# Altium schematic sheet Sheet1.SchDoc
size A4
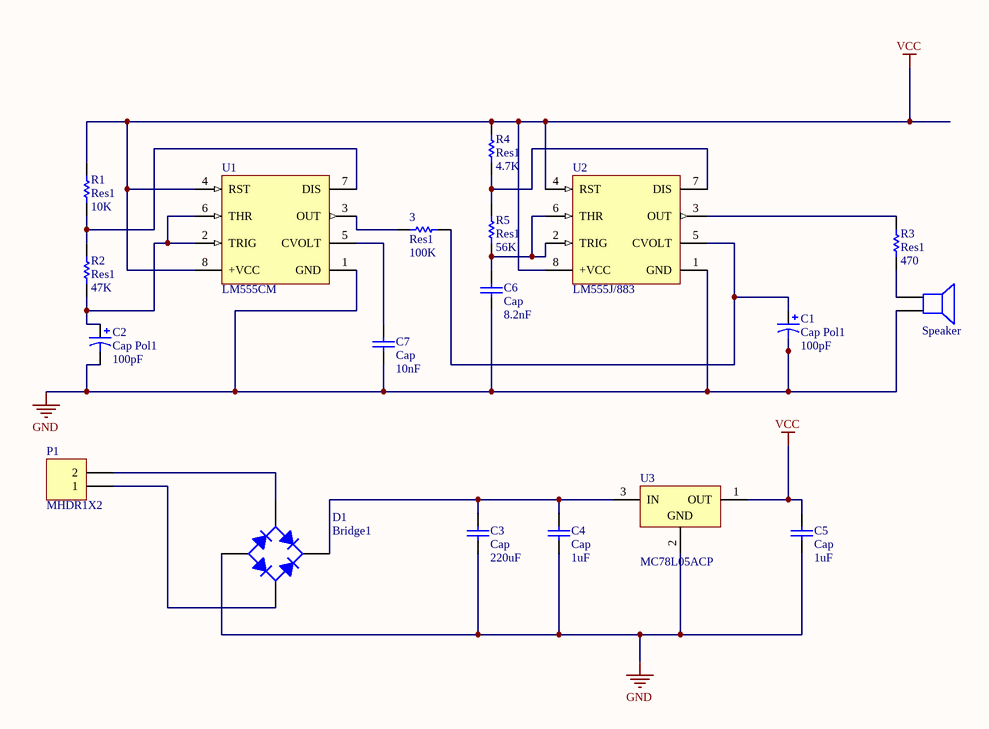
[diagram p0: Sheet1.SchDoc]

## Parts
3  Res1  value 100K  [AXIAL-0.3]
?  Speaker  [PIN2]
C1  Cap Pol1  value 100pF  [RB7.6-15]
C2  Cap Pol1  value 100pF  [RB7.6-15]
C3  Cap  value 220uF  [RAD-0.1]
C4  Cap  value 1uF  [RAD-0.1]
C5  Cap  value 1uF  [RAD-0.1]
C6  Cap  value 8.2nF  [RAD-0.1]
C7  Cap  value 10nF  [RAD-0.1]
D1  Bridge1  [D-38]
P1  MHDR1X2  [MHDR1X2]
R1  Res1  value 10K  [AXIAL-0.3]
R2  Res1  value 47K  [AXIAL-0.3]
R3  Res1  value 470  [AXIAL-0.3]
R4  Res1  value 4.7K  [AXIAL-0.3]
R5  Res1  value 56K  [AXIAL-0.3]
U1  LM555CM  [MRA08A_M]
U2  LM555J/883  [MRA08A_M]
U3  MC78L05ACP  [29-04]

## Nets
GND: ?.2 C1.2 C2.2 C3.1 C4.1 C5.1 C6.1 C7.1 D1.3(A) U1.1(GND) U2.1(GND) U3.2(GND)
VCC: C5.2 R1.2 R4.2 U1.4(RST) U1.8(+VCC) U2.4(RST) U2.8(+VCC) U3.1(OUT)
Net3_1: 3.1 U1.3(OUT)
Net3_2: 3.2 C1.1 U2.5(CVOLT)
Net?_1: ?.1 R3.1
NetC2_1: C2.1 R2.1 U1.2(TRIG) U1.6(THR)
NetC3_2: C3.2 C4.2 D1.1(K) U3.3(IN)
NetC6_2: C6.2 R5.1 U2.2(TRIG) U2.6(THR)
NetC7_2: C7.2 U1.5(CVOLT)
NetD1_2: D1.2(C) P1.1
NetD1_4: D1.4(C) P1.2
NetR1_1: R1.1 R2.2 U1.7(DIS)
NetR3_2: R3.2 U2.3(OUT)
NetR4_1: R4.1 R5.2 U2.7(DIS)

## Library data of the parts
3 R1-R5 = Res1: Resistor; Published: 8-Jun-2000; LatestRevisionDate: 17-Jul-2002; LatestRevisionNote: Re-released for DXP Platform.; PackageReference: AXIAL-0.3; Publisher: Altium Limited; PackageDescription: Axial Device, Thru-Hole; 2 Leads; 0.3 in Pin Spacing
? = Speaker: Loudspeaker; Published: 24-Mar-1999; LatestRevisionDate: 17-Jul-2002; LatestRevisionNote: Re-released for DXP Platform.; PackageReference: PIN2; Publisher: Altium Limited
C1 C2 = Cap Pol1: Polarized Capacitor (Radial); Published: 8-Jun-2000; LatestRevisionDate: 17-Jul-2002; LatestRevisionNote: Re-released for DXP Platform.; PackageReference: RB7.6-15; Publisher: Altium Limited; PackageDescription: Polarized Capacitor (Radial); 2 Leads
C3-C7 = Cap: Capacitor; Published: 8-Jun-2000; LatestRevisionDate: 17-Jul-2002; LatestRevisionNote: Re-released for DXP Platform.; PackageReference: RAD-0.3; Publisher: Altium Limited; PackageDescription: Radial Cap, Thru-Hole; 2 Leads; 0.3 in Pin Spacing
D1 = Bridge1: Full Wave Diode Bridge; Published: 8-Jun-2000; LatestRevisionDate: 29-May-2009; LatestRevisionNote: Sch pins A & K swapped.; DatasheetVersion: E2732B; PackageReference: D-38; Publisher: Altium Limited; PackageDescription: Bridge Rectifier; 4 Terminals; Body 9.4 x 9.4 mm (typ); Pitch 5.08 mm
P1 = MHDR1X2: Header, 2-Pin; LatestRevisionDate: 17-Jul-2002; LatestRevisionNote: Re-released for DXP Platform.; Publisher: Altium Limited
U1 = LM555CM: Timer, 8-pin Narrow SOIC; Manufacturer: National Semiconductor; PackageTopMarking: NSZXTT*LM*555CM; PowerWise: N; CompType: Analog IC; Published: 4-Dec-2008; DatasheetVersion: Jul-2006; PackageVersion: revM, May-2009; PackageReference: M08A; Publisher: Altium Limited; PackageDescription: SOIC Narrow, 4.9 x 3.9 x 1.45mm, 8 Lead, 1.27mm Pitch; Supplier 1: Farnell; Supplier Part Number 1: 9488227; PartNumber: LM555CM; RoHS: N; PinCount: 8; Code_JEDEC: MS-012-AA; Code_IPC: SOIC127P600-8; ComponentLink1Description: LM555 Datasheet; ComponentLink1URL: http://www.national.com/ds/LM/LM555.pdf; ComponentLink2Description: LM555 Web Page; ComponentLink2URL: http://www.national.com/pf/LM/LM555.html; ComponentLink3Description: M08A Package Page; ComponentLink3URL: http://www.national.com/packaging/folders/m08a.html
U2 = LM555J/883: Timer, 8-pin CerDIP; Manufacturer: National Semiconductor; PackageTopMarking: NSZSSXXYYA*LM555J/*883 Q; PowerWise: N; CompType: Analog IC; High-Reliability: Y; Published: 4-Dec-2008; DatasheetVersion: Jul-2006; PackageVersion: revM, Jul-2002; PackageReference: J08A; Publisher: Altium Limited; PackageDescription: Cerdip, .400 x .310in Body, 8 Lead, .300in Centers, .100in Pitch; PartNumber: LM555J/883; RoHS: N; PinCount: 8; ComponentLink1Description: LM555 Datasheet; ComponentLink1URL: http://www.national.com/ds/LM/LM555QML.pdf; ComponentLink2Description: LM555 Web Page; ComponentLink2URL: http://www.national.com/pf/LM/LM555.html; ComponentLink3Description: J08A Package Page; ComponentLink3URL: http://www.national.com/packaging/folders/j08a.html
U3 = MC78L05ACP: 3-Terminal Low-Current Positive Fixed Voltage Regulator; Published: 17-Jul-2002; DatasheetVersion: 1988; PackageVersion: 1996; PackageReference: 29-04; Publisher: Altium Limited; PackageDescription: TO, Flat Index; 3 In-Line, Axial Leads; Body Dia. 4.8mm; Leads 0.48 x 0.5 mm (max); ComponentLink1Description: Manufacturer Link; ComponentLink1URL: http://www.onsemi.com/site/products/taxonomy/0,4438,503,00.html; ComponentLink2Description: Datasheet; ComponentLink2URL: http://www.onsemi.com/pub/Collateral/MC78L00A-D.PDF